# Altium schematic sheet Sheet1.SchDoc
size A4; SheetNumber: 1; SheetTotal: 1; SPICEModelCacheEYRHZINW: <root> / <DocumentId>EYRHZINW</DocumentId> / <CacheFrame Number="0"> / <Model Name="10tq035" Kind="MDL"> / <Text>*10TQ035 MCE 3/26/98 / *Ref: IR Power Semiconductors Product Digest '94 / *MCE 35V 10A 3us pkg:TO-220 3,1 / .MODEL 10TQ035 D (IS=14.2N RS=4.2M N=1.7 BV=35 IBV=15M / + CJO=412P VJ=0.75 M=0.333 TT=4.32U EG=.69 XTI=2)</Text> / </Model> / <Model Name="ad645a" Kind="CKT"> / <Text>* AD645A SPICE Macro-model                  4/92, Rev. B / *                                           JCB / PMI / * / * Revision History: / *     Rev. B:  Converted model to include noise analysis. / * / * This version of the AD645 model simulates the worst case / * parameters of the 'A' grade.  The worst case parameters / * used correspond to those in the data sheet. / * / * Copyright 1990 by Analog Devices, Inc. / * / * Refer to "README.DOC" file for License Statement.  Use of this model / * indicates your acceptance with the terms and provisions in the License Statement. / * / * Node assignments / *                non-inverting input / *                |   inverting input / *                |   |   positive supply / *                |   |   |   negative supply / *                |   |   |   |   output / *                |   |   |   |   | / .SUBCKT AD645A   1   2   99  50  30 / * / * INPUT STAGE &amp; POLE AT 40 MHZ / * / R3   5  50    1.049 / R4   6  50    1.049 / CIN  1   2    1E-12 / C2   5   6    1.90E-9 / I1   99  4    100E-3 / IOS  1   2    0.5E-12 / EOS  65  1    POLY(1)  17 24  500E-6  1 / J1   5   2    4   JX / J2   6   7    4   JX / EN   7  65    43  0  1 / GN1  0   1    47  0  1E-6 / GN2  0   2    61  0  1E-6 / GB1  2  50    POLY(3) 4,2 5,2 50,2 0 1E-12 1E-12 1E-12 / GB2  7  50    POLY(3) 4,7 6,7 50,7 0 1E-12 1E-12 1E-12 / * / EREF 98  0    24  0   1 / * / * VOLTAGE NOISE GENERATOR / * / VN1  41  0    DC 2 / RS1  41 42    11.8E3 / RS2  42 43    1.2E9 / CS1  42 43    79.8E-11 / RS3  43 44    1.2E9 / CS2  43 44    79.8E-11 / RS4  44 45    11.8E3 / VN2  0  45    DC 2 / * / * CURRENT NOISE GENERATOR / * / VN3  46  0    DC 2 / RN5  46 47    144 / RN6  47 48    144 / VN4  0  48    DC 2 / * / * CURRENT NOISE GENERATOR / * / VN5  60  0    DC 2 / RN7  60 61    144 / RN8  61 62    144 / VN6  0  62    DC 2 / * / * SECOND STAGE &amp; POLE AT 3 HZ / * / R5   9  98    5.26E5 / C3   9  98    1.00E-7 / G1   98  9    5  6  9.53E-1 / V2   99  8    4.7 / V3   10 50    4.7 / D1   9   8    DX / D2   10  9    DX / * / * NEGATIVE ZERO AT 15 MHZ / * / R6   11 12     1E6 / C4   11 12     -10.6E-15 / R7   12 98     1 / E2   11 98     9  24  1E6 / * / * POLE AT 40 MHZ / * / R8   13 98     1E3 / C5   13 98     3.98E-12 / G2   98 13     12 24  1E-3 / * / * POLE AT 40 MHZ / * / R9   14 98     1E3 / C6   14 98     3.98E-12 / G3   98 14     13 24  1E-3 / * / * POLE AT 40 MHZ / * / R10  15 98     1E3 / C7   15 98     3.98E-12 / G4   98 15     14 24  1E-3 / * / * COMMON-MODE GAIN NETWORK WITH ZERO AT 600 HZ / * / R11  16 17     1E6 / C8   16 17     2.65E-10 / R12  17 98     1 / E3   16 98     POLY(2) 1  98  2  98  0  15.8  15.8 / * / * POLE AT 40 MHZ / * / R13  18 98     1E3 / C9   18 98     3.98E-12 / G5   98 18     15 24  1E-3 / * / * OUTPUT STAGE / * / R14  24 99     2000E3 / R15  24 50     2000E3 / ISY  99 50     -96.5E-3 / R16  29 99     360 / R17  29 50     360 / L1   29 30     1E-8 / G6   27 50     18 29  2.78E-3 / G7   28 50     29 18  2.78E-3 / G8   29 99     99 18  2.78E-3 / G9   50 29     18 50  2.78E-3 / V4   25 29     2.0 / V5   29 26     2.0 / D3   18 25     DX / D4   26 18     DX / D5   99 27     DX / D6   99 28     DX / D7   50 27     DY / D8   50 28     DY / F1   29  0     V4  1 / F2   0  29     V5  1 / * / * MODELS USED / * / .MODEL JX PJF(BETA=4.54  VTO=-2.000  IS=2.5E-12 RD=0.1 / + RS=0.1 CGD=1E-15 CGS=1E-15) / .MODEL DX   D(IS=1E-15 RS=10 CJO=1E-15) / .MODEL DY   D(IS=1E-15 BV=50 RS=10 CJO=1E-15) / .MODEL DEN  D(IS=1E-12 RS=7409.6 KF=2.051E-15 AF=1) / .MODEL DIN  D(IS=1E-12 RS=41.5 KF=0 AF=1) / .ENDS AD645A</Text> / </Model> / </CacheFrame> / </root>
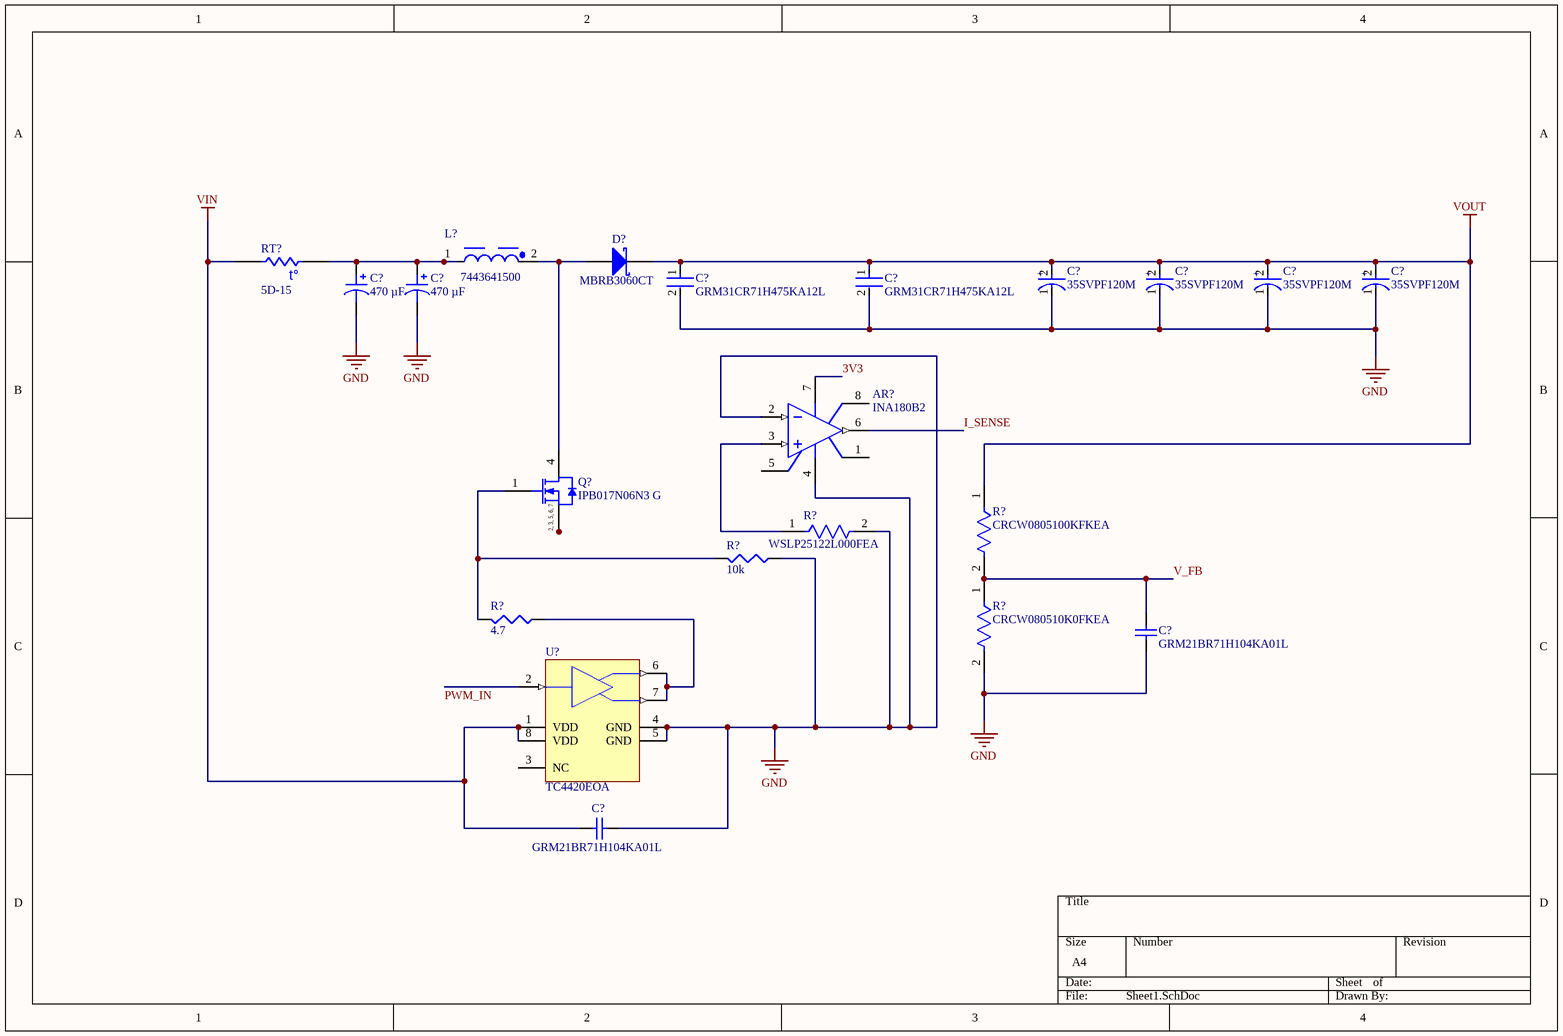
[diagram p0: Sheet1.SchDoc]

## Parts
(Parts that share a designator on the sheet are numbered #1, #2 ... from top to bottom, then left to right.)
AR?  INA180B2  [H-08A]
C?#1  GRM31CR71H475KA12L  [FP-GRM31C-0_2-e0_3_0_8-IPC_C]
C?#2  GRM31CR71H475KA12L  [FP-GRM31C-0_2-e0_3_0_8-IPC_C]
C?#3  35SVPF120M  [FP-OS-CON-SMT-F12-MFG]
C?#4  35SVPF120M  [FP-OS-CON-SMT-F12-MFG]
C?#5  35SVPF120M  [FP-OS-CON-SMT-F12-MFG]
C?#6  35SVPF120M  [FP-OS-CON-SMT-F12-MFG]
C?#7  470 µF  [CAP ALSMD 8.3MM H10.5MM]
C?#8  470 µF  [CAP ALSMD 8.3MM H10.5MM]
C?#9  GRM21BR71H104KA01L  [CAPC2013X135X45ML10T25]
C?#10  GRM21BR71H104KA01L  [CAPC2013X135X45ML10T25]
D?  MBRB3060CT  [TO-220AC]
L?  7443641500  [WE-HCF_2818]
Q?  IPB017N06N3 G  [INF-PG-TO-263-7-2_N]
R?#1  CRCW0805100KFKEA  [FP-CRCW0805-e3-MFG]
R?#2  WSLP25122L000FEA  [FP-WSLP2512-0R001-0R0049-MFG]
R?#3  value 10k  [J1-0603]  (hidden comment: Res3)
R?#4  CRCW080510K0FKEA  [FP-CRCW0805-e3-IPC_A]
R?#5  value 4.7  [J1-0603]  (hidden comment: Res3)
RT?  5D-15  [6-0805_N]
U?  TC4420EOA  [SOIC-OA8_M]

## Nets
GND: AR?.2(IN-) AR?.4(V-) C?#1.2 C?#2.2 C?#3.1(C) C?#4.1(C) C?#5.1(C) C?#6.1(C) C?#7.2 C?#8.2 C?#9.2 C?#10.1 R?#2.2 R?#3.1 R?#4.2 U?.4(GND) U?.5(GND)
VIN: C?#10.2 RT?.2 U?.1(VDD) U?.8(VDD)
VOUT: C?#1.1 C?#2.1 C?#3.2(A) C?#4.2(A) C?#5.2(A) C?#6.2(A) D?.1(K) R?#1.1
3V3: AR?.7(V+)
I_SENSE: AR?.6(OUT)
PWM_IN: U?.2(IN)
V_FB: C?#9.1 R?#1.2 R?#4.1
NetAR?_3: AR?.3(IN+) R?#2.1
NetC?#7_1: C?#7.1 C?#8.1 L?.1 RT?.1
NetD?_3: D?.3(A) L?.2 Q?.4(DRAIN)
NetQ?_1: Q?.1(GATE) R?#3.2 R?#5.2
NetQ?_2: Q?.2(SOURCE) Q?.3(SOURCE) Q?.5(SOURCE) Q?.6(SOURCE) Q?.7(SOURCE)
NetR?#5_1: R?#5.1 U?.6(OUT) U?.7(OUT)

Not connected (* = marked no-connect by the designer): AR? 1(OS_NUL) 5(OS_NUL) 8(TAB); U? 3(NC)

## Notes on the sheet
- (in symbol CMP-1091-00282-1) 2, 3, 5, 6, 7
- (in symbol CMP-05428-000082-1) +
- (in symbol Res Thermal) t°

## Library data of the parts
AR? = Op Amp: Published: 8-Jun-2000; LatestRevisionDate: 17-Jul-2002; LatestRevisionNote: Re-released for DXP Platform.; DatasheetVersion: REV. B; PackageVersion: 1990; PackageReference: H-08A; Publisher: Altium Limited; PackageDescription: Can; 8 Leads; Pin Circle Dia. 5.08 mm; Lead Dia. 0.53 mm (max); ComponentLink1Description: Manufacturer Link; ComponentLink1URL: http://www.analog.com/
C?#1 C?#2 = CMP-1037-04923-3: Chip Multilayer Ceramic Capacitors for General Purpose, 1206, 4.7uF, X7R, 15%, 10%, 50V; Height: 1.6mm; Voltage: 50V; Capacitance: 4.7uF; Lead Free: Lead Free; Max Operating Temperature: 125°C; Packaging: Tape and Reel; REACH SVHC: No SVHC; Voltage Rating: 50V; Mount: Surface Mount; Termination: SMD/SMT; Tolerance: 10%; Case/Package: 1206; Material: Ceramic; Depth: 1.6mm; Length: 3.2mm; Case Code (Metric): 3216; Voltage Rating (DC): 50V; Case Code (Imperial): 1206; Radiation Hardening: No; Width: 0.063inch; Thickness: 0.071inch; Package Quantity: 2000; Min Operating Temperature: -55°C; Dielectric: X7R
C?#3-C?#6 = CMP-05428-000082-1: Conductive Polymer Aluminum Solid Capacitors (OS-CON) 120uF ±20% 35V RADIAL SMT 10x12.6mm; Life (Hours): 5000Hour; Ripple Current: 4.4A; Polarity: Polar; ESR (Equivalent Series Resistance): 18mR; Dissipation Factor: 12%; Leakage Current: 840uA; REACH SVHC: No SVHC; Length: 12.6mm; Capacitance: 120uF; Series: OS-CON™, SVPF; Case/Package: Radial; Number of Pins: 12; Min Operating Temperature: -55°C; Package Quantity: 400; Height: 12.6mm; Voltage Rating: 35V; Lead Free: Lead Free; Max Operating Temperature: 105°C; Voltage: 35V; Mount: Surface Mount; Packaging: Tape and Reel; Voltage Rating (DC): 35V; RoHS Compliant: Yes; Height - Seated (Max): 0.5inch; Tolerance: 20%; Diameter: 10mm; Termination: SMD/SMT; Ripple Current (AC): 4.4A
C?#7 C?#8 = EMZS350ARA471MHA0G: CAP ALUM 470UF 20% 35V SMD; manufacturer: United Chemi-Con; ESR (Equivalent Series Resistance): 80mOhm @ 100kHz; Lifetime @ Temp.: 2000 Hrs @ 105°C; Polarization: Polar; Ripple Current @ High Frequency: 850 mA @ 100 kHz; Ripple Current @ Low Frequency: 425 mA @ 120 Hz; Surface Mount Land Size: 0.327" L x 0.327" W (8.30mm x 8.30mm); Part Number: EMZS350ARA471MHA0G; Applications: Automotive; Capacitance: 470 µF; componentlink1description: Datasheet; componentlink1url: //media.digikey.com/pdf/Data%20Sheets/United%20Chemi-Con%20PDFs/MZS_Series_NPI.pdf; componentlink2description: DigiKey Link; componentlink2url: https://www.digikey.com/en/products/detail/united-chemi-con/EMZS350ARA471MHA0G/8637079; Device Package: Radial, Can - SMD; Height - Seated (Max): 0.413" (10.50mm); lastupdated: 4/5/2026 8:53:57 PM; Lifecycle Status: Active; Minimum Order: 1; Mounting Type: Surface Mount; Operating Temperature: -55°C ~ 105°C; Package / Case: Radial, Can - SMD; packaging: TapeAndReel; partid: 7526; Part Status: Active; price: 0.40; Ratings: AEC-Q200; series: Alchip™- MZS; Size / Dimension: 0.315" Dia (8.00mm); Supplier 1: DigiKey; Supplier Part Number 1: 565-5123-1-ND; Tolerance: ±20%; value: 470 µF; Voltage - Rated: 35 V
C?#9 C?#10 = CMP-2100-03644-1: Chip Capacitor, 0.1 uF, +/- 10%, 50 V, -55 to 125 degC, 0805 (2012 Metric), RoHS, Tape and Reel; Manufacturer: Murata; Voltage: 50V; Capacitance: 100nF; Insulation Resistance: 10GR; Dielectric Material: Ceramic; Dielectric: X7R; Package Description: 2-Pin Surface Mount Device, Body 2 x 1.25 mm; Manufacturer URL: http://www.murata.com/; Case Code (Imperial): 0805; Datasheet URL: http://psearch.en.murata.com/capacitor/product/GRM21BR71H104KA01%23.pdf; Termination: SMD/SMT; Lead Free: LeadFree; Package Quantity: 1; Mount: SurfaceMount; REACH SVHC: Unknown; Thickness: 0.053inch; Height: 1.25mm; Case/Package: 0805; Voltage Rating: 50V; Width: 0.049inch; Case Code (Metric): 2012; Material: Ceramic; Min Operating Temperature: -55degC; RoHSCompliant: true; Datasheet Version: 42675.0; Voltage Rating (DC): 50V; Tolerance: 10%; Package Reference: 0805; Depth: 1.25mm; Length: 2mm; Max Operating Temperature: 125degC; Packaging: TapeandReel; Number of Pins: 2; Radiation Hardening: No
D? = Diode 10TQ035: Schottky Rectifier; Note: Terminal 2 is the TAB and is electrically connected to the cathode; Published: 8-Jun-2000; LatestRevisionDate: 17-Jul-2002; LatestRevisionNote: Re-released for DXP Platform.; DatasheetVersion: PD-2.057B; PackageVersion: Feb-1998; PackageReference: TO-220AC; Publisher: Altium Limited; PackageDescription: TO, Thru-Hole, Vertical, Heatsink Mounted; 3 In-Line Leads (1 Absent); Pitch 2.54 mm; ComponentLink1Description: Manufacturer Link; ComponentLink1URL: http://www.irf.com/; ComponentLink2Description: Datasheet; ComponentLink2URL: http://www.irf.com/product-info/datasheets/data/10tq.pdf
L? = CMP-1378-00012-4: PowerChoke Shielded Wirewound 15uH 15% 100KHz Ferrite 30A 0.00264Ohm DCR Automotive Tray; Inductance: 15µH; Self Resonant Frequency: 11MHz; Series Resistance: 2.4mΩ; Saturation Current: 22A; Tolerance: 15%; Number of Pins: 2; Max Operating Temperature: 125°C; Min Operating Temperature: -40°C; Termination: SMD/SMT; Inductance Tolerance: 15%; Composition: Wirewound; Packaging: Cut Tape; Height: 18.5mm; Ambient Temperature Range Low: -40°C; REACH SVHC: Unknown; Height - Seated (Max): 18.4912mm; Max DC Current: 30A; DC Resistance (DCR): 2.4mΩ; Current Rating: 30A; RMS Current (Irms): 30A; Test Frequency: 100kHz; RoHS: Compliant; Width: 28mm; Length: 27mm; Case/Package: Nonstandard; Shielding: Shielded; Mount: Surface Mount; Core Material: Ferrite; Ambient Temperature Range High: 75°C
Q? = CMP-1091-00282-1: N-Channel OptiMOS 3 Power-Transistor, 60 V VDS, 180 A ID, -55 to 175 degC, PG-TO-263-7-2, Reel, Green; Manufacturer: Infineon; Rth: 0.6Â K/W; IDpuls (max): 720Â A; Ptot (max): 250Â W; QG: 206Â nC; Green: TRUE; Polarity: N; RthJA (max): 62 K/W; VDS (max): 60Â V; RDS (on) (max): 1.7Â mOhm; VGS(th) (max): 4Â V; ID (max): 180Â A; VGS(th) (min): 2Â V; DatasheetVersion: Rev. 2.2; Packing: Reel; ComponentLink2Description: Datasheet; PackageReference: PG-TO-263-7-2; PackageVersion: Rev. 01, 11/2007; RthJC (max): 0.6Â K/W; PackageDescription: 7-Pin Plastic (Green) Transistor Single Outline Package, 10.1 x 8.98 mm Body, 1.27 mm Pitch; ComponentLink3Description: Package Specification; ComponentLink2URL: http://www.infineon.com/dgdl/IPB017N06N3_Rev2.2.pdf?folderId=db3a30431441fb5d01148ca9f1be0e77&fileId=db3a30431ddc9372011e264a7ab746ea; Mounting Technology: Surface Mount; Halogen-free: TRUE; PartNumber: IPB017N06N3 G; ComponentLink1Description: Manufacturer URL; ComponentLink3URL: http://www.infineon.com/dgdl/BTS621L1_20030922.pdf?folderId=db3a30431400ef68011421b54e2e0564&fileId=db3a304333227b5e0133258247c72ecc&sId=db3a30433d68e984013d8539603e0d72; ComponentLink1URL: http://www.infineon.com/
R?#1 = CMP-2001-04899-2: RES Thick Film, 100kΩ, 1%, 0.125W, 100ppm/°C, 0805; Resistance: 100kR; Power Rating: 125mW; Voltage Rating: 150V; Case/Package: 0805; Max Operating Temperature: 155°C; Case Code (Imperial): 0805; Lead Free: Lead Free; Weight: 0.000194oz; Number of Pins: 2; Package Quantity: 5000; Height: 0.45mm; Composition: Thick Film; Military Standard: Not; Tolerance: 1%; Case Code (Metric): 2012; Termination: SMD/SMT; Mount: Surface Mount; Radiation Hardening: No; Width: 1.25mm; Length: 2mm; Depth: 1.25mm; Packaging: Tape and Reel; Min Operating Temperature: -55°C; Contact Plating: Tin; Temperature Coefficient: 100ppm/°C; Voltage Rating (DC): 150V
R?#2 = CMP-02407-010958-1: RES 0.002 OHM 1% 3W 2512; Resistance: 2MR; Temperature Coefficient: 275ppm/°C; Size Code: 2512; Width: 3.2mm; Resistor Type: Metal Strip; Packaging: Tape and Reel; Weight: 0.001429oz; RoHS Compliant: Yes; Case Code (Metric): 6432; Case/Package: 2512; Tolerance: 1%; Length: 6.4mm; Case Code (Imperial): 2512; Power Rating: 3W; Min Operating Temperature: -65°C; Mount: Surface Mount; Max Operating Temperature: 170°C; Package Quantity: 2000; Series: WSLP; Height: 0.635mm; Termination: SMD/SMT; Lead Free: Lead Free
R?#3 R?#5 = Res3: Resistor; Published: 8-Jun-2000; LatestRevisionDate: 29-May-2009; LatestRevisionNote: IPC-7351 Footprint Added.; PackageReference: J1-0603; Publisher: Altium Limited; PackageDescription: Chip Resistor
R?#4 = CMP-2001-04908-2: RES Thick Film, 10kΩ, 1%, 0.125W, 100ppm/°C, 0805; Resistance: 10kR; Voltage Rating (DC): 150V; Power Rating: 125mW; Weight: 0.000194oz; Package Quantity: 5000; Military Standard: Not; Max Operating Temperature: 155°C; Temperature Coefficient: 100ppm/°C; Contact Plating: Tin; Width: 1.25mm; Height: 0.45mm; Radiation Hardening: No; Tolerance: 1%; Min Operating Temperature: -55°C; Voltage Rating: 150V; Length: 2mm; Depth: 1.25mm; Termination: SMD/SMT; Packaging: Tape and Reel; Case/Package: 0805; Case Code (Metric): 2012; Lead Free: Lead Free; Case Code (Imperial): 0805; Composition: Thick Film
RT? = Res Thermal: Thermistor; Published: 24-Mar-1999; LatestRevisionDate: 29-May-2009; LatestRevisionNote: IPC-7351 Footprint Added.; PackageVersion: Mar-2003; PackageReference: 6-0805; Publisher: Altium Limited; PackageDescription: Chip Resistor 0805 Case Size; Code_IPC: RESC2012
U? = CMP-0137-00254-1: 6A High-Speed MOSFET Driver, Non-Inverting, Industrial Temperature; PackageReference: SOIC-OA8; DatasheetVersion: revC, Aug-2004; Code_IPC: SOIC127P600-8; PackageVersion: revBB, Aug-2009; PackageDescription: 8-Lead Plastic Small Outline (OA) - Narrow, 3.90mm Body [SOIC]